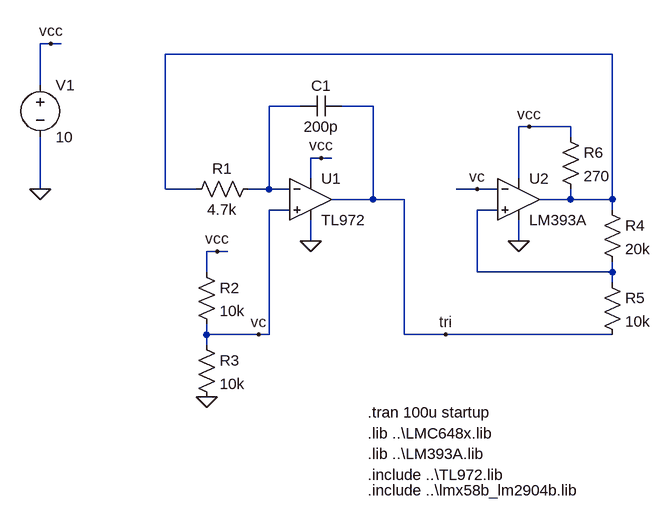
[diagram p0: schematic ramp-gen.asc]
ramp-gen.asc, the LTspice schematic file:
Version 4
SHEET 1 1032 680
WIRE -176 -112 -192 -112
WIRE -160 -112 -176 -112
WIRE 688 -96 0 -96
WIRE -192 -48 -192 -112
WIRE 208 -16 160 -16
WIRE 320 -16 272 -16
WIRE 560 16 544 16
WIRE 624 16 560 16
WIRE 624 32 624 16
WIRE 240 64 224 64
WIRE 256 64 240 64
WIRE 224 96 224 64
WIRE 544 96 544 16
WIRE -192 112 -192 32
WIRE 0 112 0 -96
WIRE 48 112 0 112
WIRE 160 112 160 -16
WIRE 160 112 128 112
WIRE 192 112 160 112
WIRE 480 112 448 112
WIRE 512 112 480 112
WIRE 320 128 320 -16
WIRE 320 128 256 128
WIRE 368 128 320 128
WIRE 624 128 624 112
WIRE 624 128 576 128
WIRE 688 128 688 -96
WIRE 688 128 624 128
WIRE 192 144 160 144
WIRE 512 144 480 144
WIRE 688 144 688 128
WIRE 224 192 224 160
WIRE 544 192 544 160
WIRE 80 208 64 208
WIRE 96 208 80 208
WIRE 64 240 64 208
WIRE 480 240 480 144
WIRE 688 240 688 224
WIRE 688 240 480 240
WIRE 688 256 688 240
WIRE 64 336 64 320
WIRE 144 336 64 336
WIRE 160 336 160 144
WIRE 160 336 144 336
WIRE 368 336 368 128
WIRE 432 336 368 336
WIRE 688 336 432 336
WIRE 64 352 64 336
FLAG -192 112 0
FLAG 224 192 0
FLAG -176 -112 vcc
FLAG 240 64 vcc
FLAG 560 16 vcc
FLAG 544 192 0
FLAG 64 432 0
FLAG 80 208 vcc
FLAG 144 336 vc
FLAG 480 112 vc
FLAG 432 336 tri
SYMBOL voltage -192 -64 R0
WINDOW 123 0 0 Left 0
WINDOW 39 0 0 Left 0
SYMATTR InstName V1
SYMATTR Value 10
SYMBOL OpAmps\\opamp2 224 64 R0
SYMATTR InstName U1
SYMATTR Value TL972
SYMBOL res 144 96 R90
WINDOW 0 0 56 VBottom 2
WINDOW 3 32 56 VTop 2
SYMATTR InstName R1
SYMATTR Value 4.7k
SYMBOL cap 272 -32 R90
WINDOW 0 0 32 VBottom 2
WINDOW 3 32 32 VTop 2
SYMATTR InstName C1
SYMATTR Value 200p
SYMBOL res 48 224 R0
SYMATTR InstName R2
SYMATTR Value 10k
SYMBOL res 48 336 R0
SYMATTR InstName R3
SYMATTR Value 10k
SYMBOL res 672 128 R0
SYMATTR InstName R4
SYMATTR Value 20k
SYMBOL res 672 240 R0
SYMATTR InstName R5
SYMATTR Value 10k
SYMBOL OpAmps\\opamp2 544 64 R0
SYMATTR InstName U2
SYMATTR Value LM393A
SYMBOL res 608 16 R0
SYMATTR InstName R6
SYMATTR Value 270
TEXT 312 456 Left 2 !.tran 100u startup
TEXT 312 488 Left 2 !.lib ..\\LMC648x.lib
TEXT 312 520 Left 2 !.lib ..\\LM393A.lib
TEXT 312 552 Left 2 !.include ..\\TL972.lib
TEXT 312 576 Left 2 !.include ..\\lmx58b_lm2904b.lib

The netlist it stands for:
* ramp-gen.asc
V1 vcc 0 10
XU1 vc N002 vcc 0 tri TL972  ; pins In+ In- V+ V- OUT
R1 N002 N001 4.7k
C1 tri N002 200p
R2 vcc vc 10k
R3 vc 0 10k
R4 N001 N003 20k
R5 N003 tri 10k
XU2 N003 vc vcc 0 N001 LM393A  ; pins In+ In- V+ V- OUT
R6 vcc N001 270
.tran 100u startup
.lib ..\LMC648x.lib
.lib ..\LM393A.lib
.include ..\TL972.lib
.include ..\lmx58b_lm2904b.lib
.backanno
.end